# Altium schematic sheet 1602各引脚接线图.SCHDOC
size 127 x 127 mm
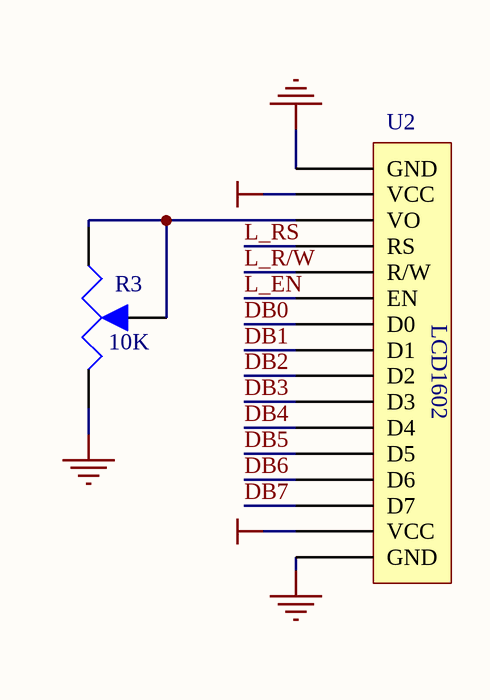
[diagram p0: 1602各引脚接线图.SCHDOC]

## Parts
R3  value 10K  [3296]  (hidden comment: Variable Resistor)
U2  LCD160  [LCD1602]  (value not drawn)

## Nets
+5V: U2.2(VCC) U2.15(VCC)
GND: R3.2 U2.1(GND) U2.16(GND)
DB0: U2.7(D0)
DB1: U2.8(D1)
DB2: U2.9(D2)
DB3: U2.10(D3)
DB4: U2.11(D4)
DB5: U2.12(D5)
DB6: U2.13(D6)
DB7: U2.14(D7)
L_EN: U2.6(EN)
L_R/W: U2.5(R/W)
L_RS: U2.4(RS)
NetR3_0: R3.0 R3.1 U2.3(VO)

## Library data of the parts
U2 = LCD1602